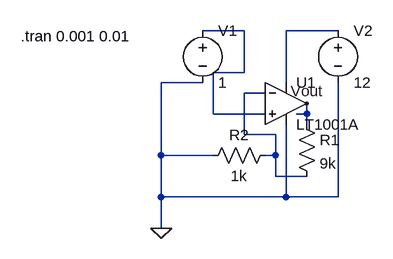
[diagram p0: schematic OpAmpNonInverting.asc]
OpAmpNonInverting.asc, the LTspice schematic file:
Version 4
SHEET 1 880 680
WIRE 400 192 336 192
WIRE 544 192 464 192
WIRE 400 256 400 192
WIRE 400 256 352 256
WIRE 336 272 272 272
WIRE 464 272 464 192
WIRE 432 288 400 288
WIRE 352 320 352 256
WIRE 432 320 352 320
WIRE 496 320 496 304
WIRE 496 320 480 320
WIRE 496 336 496 320
WIRE 400 352 400 288
WIRE 448 352 400 352
WIRE 272 384 272 272
WIRE 352 384 272 384
WIRE 448 384 448 352
WIRE 448 384 432 384
WIRE 448 416 448 384
WIRE 496 416 448 416
WIRE 272 448 272 384
WIRE 464 448 464 336
WIRE 464 448 272 448
WIRE 544 448 544 272
WIRE 544 448 464 448
WIRE 272 496 272 448
FLAG 272 496 0
FLAG 496 304 Vout
SYMBOL Opamps/LT1001A 464 240 R0
SYMATTR InstName U1
SYMBOL voltage 336 176 R0
SYMATTR InstName V1
SYMATTR Value 1
SYMBOL res 480 320 R0
SYMATTR InstName R1
SYMATTR Value 9k
SYMBOL res 448 368 R90
WINDOW 0 0 56 VBottom 2
WINDOW 3 32 56 VTop 2
SYMATTR InstName R2
SYMATTR Value 1k
SYMBOL voltage 544 176 R0
SYMATTR InstName V2
SYMATTR Value 12
TEXT 56 200 Left 2 !.tran 0.001 0.01

The netlist it stands for:
* OpAmpNonInverting.asc
XU1 N001 N003 N002 0 Vout LT1001  ; LT1001A, pins In+ In- V+ V- OUT
V1 N001 0 1
R1 Vout N003 9k
R2 N003 0 1k
V2 N002 0 12
.tran 0.001 0.01
.lib LTC.lib
.backanno
.end